# EasyEDA schematic launch-pad_board_schematic_r1.1.json
TITLE: Launch-Pad - Board; REV: 1.1; Date: 2022-09-24; Sheet: 1/1; Company: Lrocket
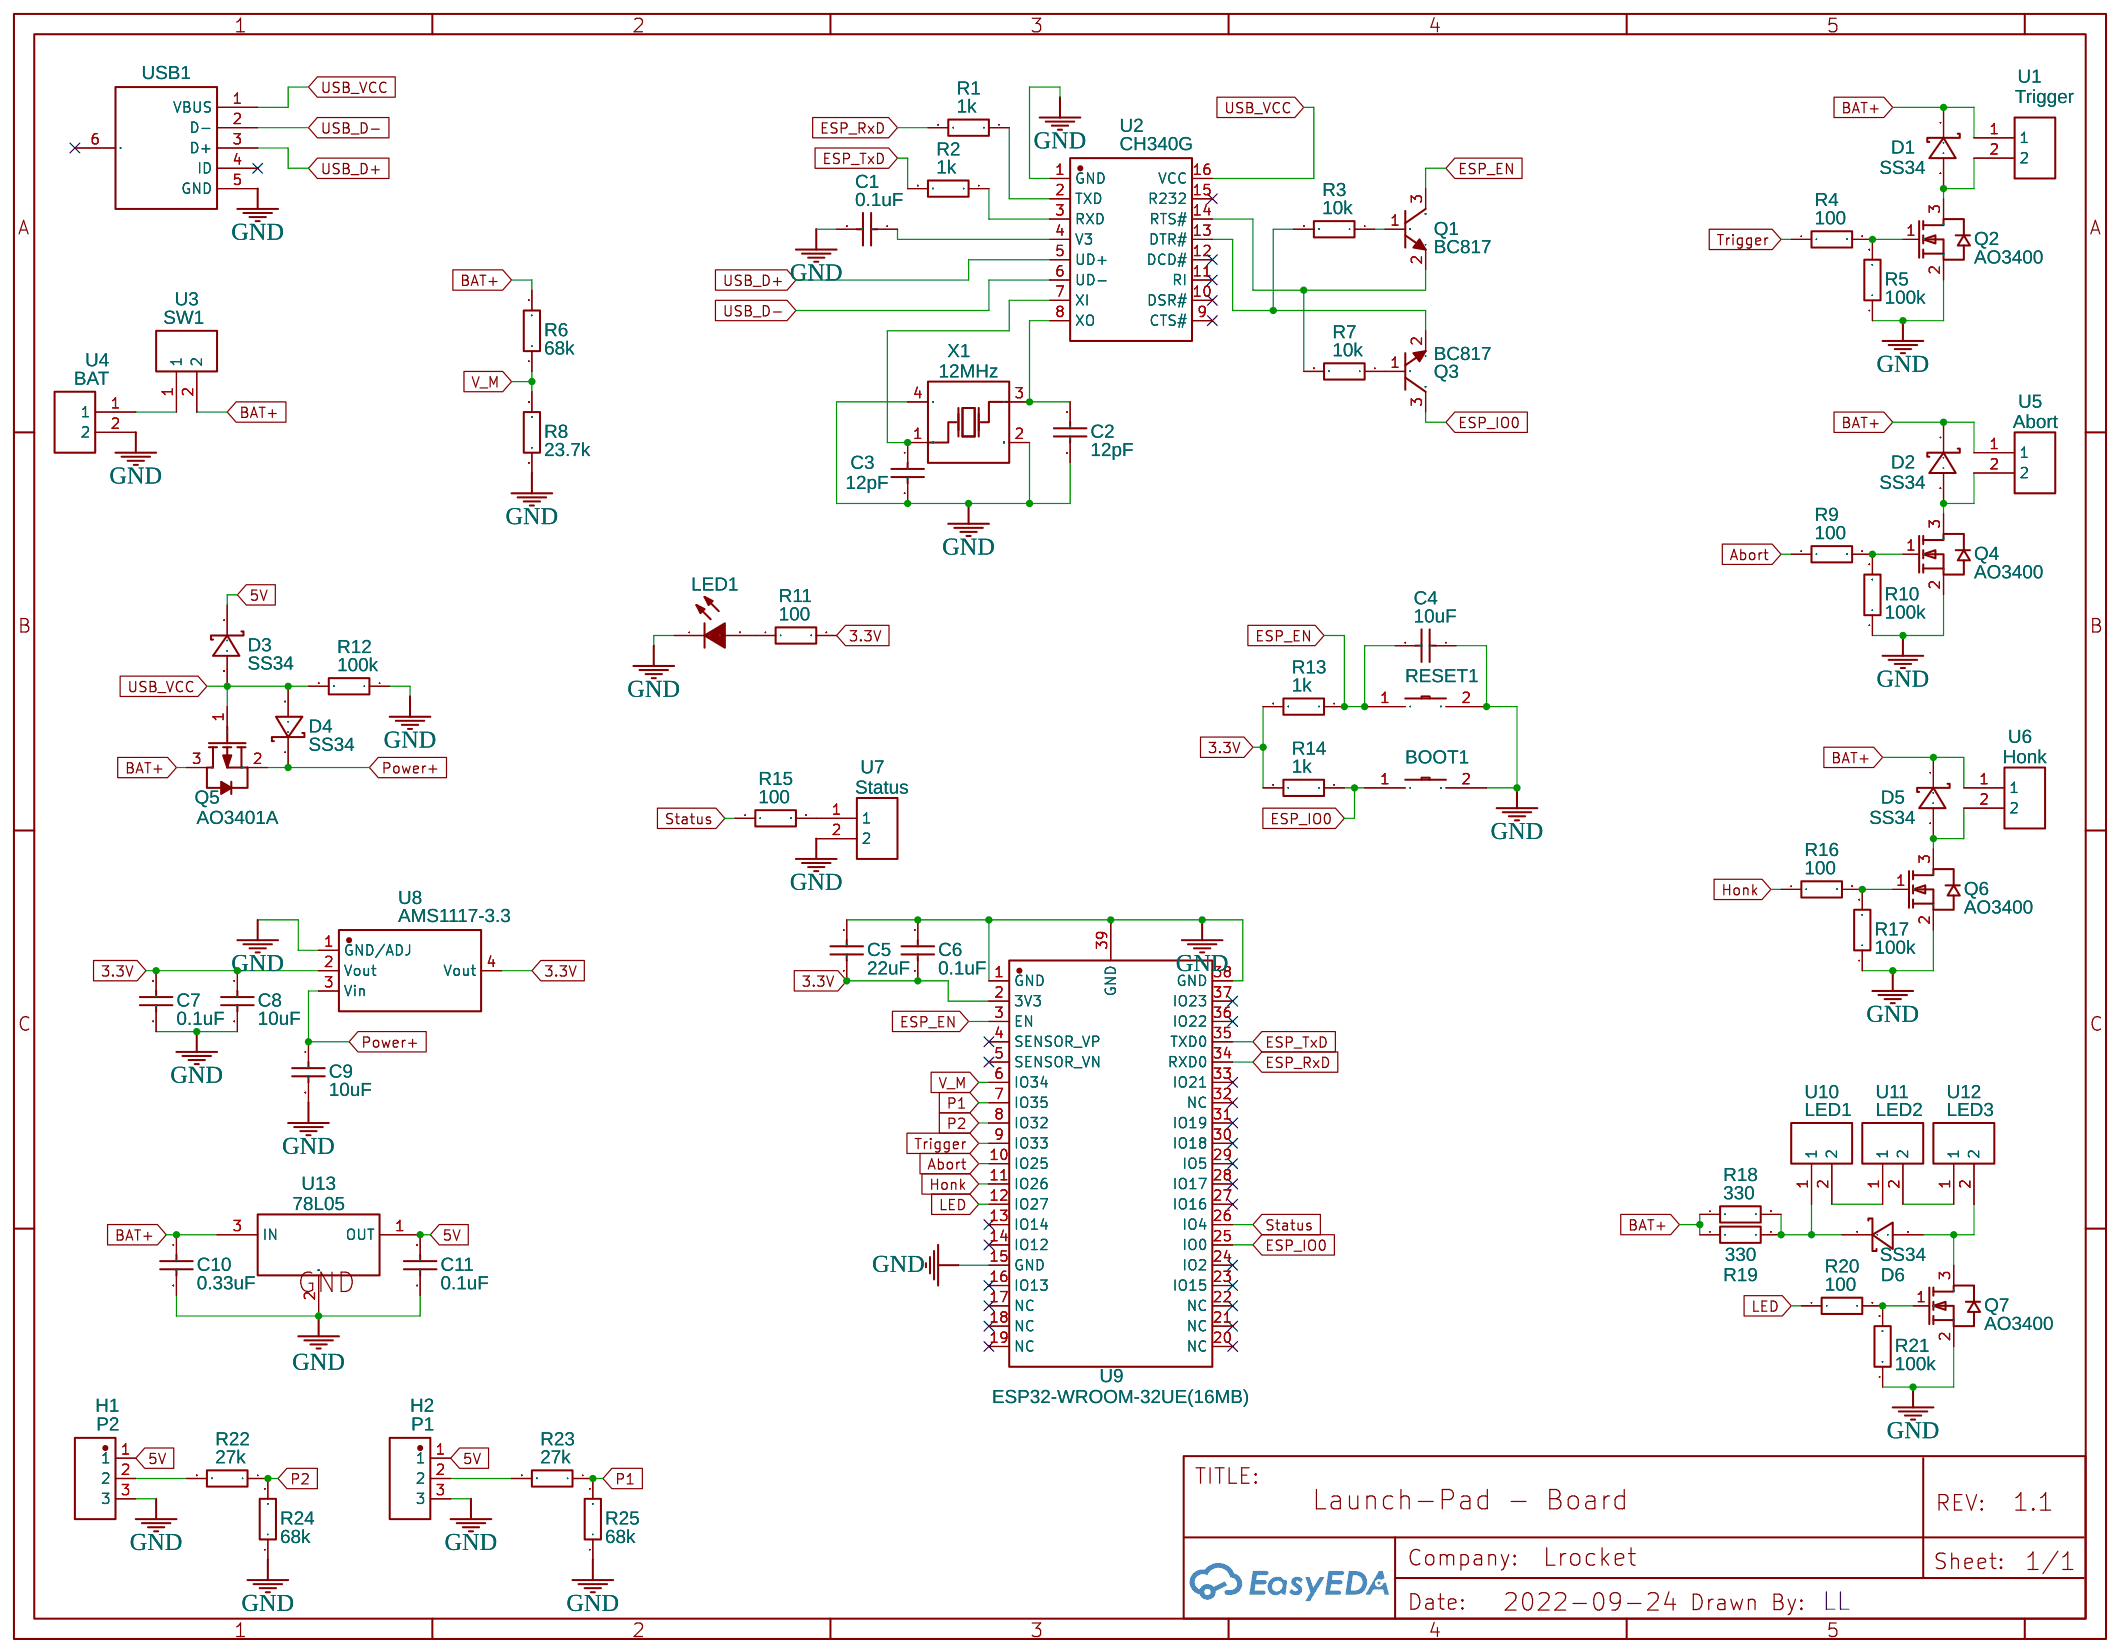
[diagram p0: schematic sheet]

## Parts
BOOT1  TS-1101-C-W  [SW-SMD_L6.0-W3.3-LS8.0]
C1  0.1uF  [C0603]
C2  12pF  [C0603]
C3  12pF  [C0603]
C4  10uF  [C0603]
C5  22uF  [C0603]
C6  0.1uF  [C0603]
C7  0.1uF  [C0603]
C8  10uF  [C0603]
C9  10uF  [C0603]
C10  0.33uF  [C0603]
C11  0.1uF  [C0603]
D1  SS34  [DO-214AC_L4.3-W2.7-LS5.3-RD]
D2  SS34  [DO-214AC_L4.3-W2.7-LS5.3-RD]
D3  SS34  [DO-214AC_L4.3-W2.7-LS5.3-RD]
D4  SS34  [DO-214AC_L4.3-W2.7-LS5.3-RD]
D5  SS34  [DO-214AC_L4.3-W2.7-LS5.3-RD]
D6  SS34  [DO-214AC_L4.3-W2.7-LS5.3-RD]
H1  P2  [SMD-HDR_3P_2.54]
H2  P1  [SMD-HDR_3P_2.54]
LED1  FC-D1608WD-460H5  [LED0603-RD]
Q1  BC817  [SOT-23-3_L2.9-W1.6-P1.90-LS2.8-BR]
Q2  AO3400  [SOT-23-3_L2.9-W1.3-P1.90-LS2.4-BR]
Q3  BC817  [SOT-23-3_L2.9-W1.6-P1.90-LS2.8-BR]
Q4  AO3400  [SOT-23-3_L2.9-W1.3-P1.90-LS2.4-BR]
Q5  AO3401A  [SOT-23_L2.9-W1.3-P1.90-LS2.4-BR]
Q6  AO3400  [SOT-23-3_L2.9-W1.3-P1.90-LS2.4-BR]
Q7  AO3400  [SOT-23-3_L2.9-W1.3-P1.90-LS2.4-BR]
R1  1k  [R0603]
R2  1k  [R0603]
R3  10k  [R0603]
R4  100  [R0603]
R5  100k  [R0603]
R6  68k  [R0603]
R7  10k  [R0603]
R8  23.7k  [R0603]
R9  100  [R0603]
R10  100k  [R0603]
R11  100  [R0603]
R12  100k  [R0603]
R13  1k  [R0603]
R14  1k  [R0603]
R15  100  [R0603]
R16  100  [R0603]
R17  100k  [R0603]
R18  330  [R0603]
R19  330  [R0603]
R20  100  [R0603]
R21  100k  [R0603]
R22  27k  [R0603]
R23  27k  [R0603]
R24  68k  [R0603]
R25  68k  [R0603]
RESET1  TS-1101-C-W  [SW-SMD_L6.0-W3.3-LS8.0]
U1  Trigger  [HEADER_SMD2]
U2  CH340G  [SOIC-16_L9.9-W3.9-P1.27-LS6.0-BL]
U3  SW1  [HEADER_SMD2]
U4  BAT  [HEADER_SMD2]
U5  Abort  [HEADER_SMD2]
U6  Honk  [HEADER_SMD2]
U7  Status  [HEADER_SMD2]
U8  AMS1117-3.3  [SOT-223-3_L6.5-W3.4-P2.30-LS7.0-BR]
U9  ESP32-WROOM-32UE(16MB)  [WIFI-SMD_ESP32-WROOM-32UE]
U10  LED1  [HEADER_SMD2]
U11  LED2  [HEADER_SMD2]
U12  LED3  [HEADER_SMD2]
U13  78L05  [SOT-89-3_L4.5-W2.5-P1.50-LS4.2-BR]
USB1  USB1  [MICRO-USB-SMD_U254-051T-4BH83-S1S]
X1  12MHz  [OSC-SMD_4P-L3.2-W2.5-BL]

## Library data of the parts
BOOT1 RESET1 = TS-1101-C-W: Supplier: LCSC; Supplier Part: C318938; Manufacturer: XKB Connectivity(中国星坤); Contributor: LCSC; JLCPCB Part Class: Extended Part
C1-C11 = CC0603KRX7R9BB103: Supplier: LCSC; Manufacturer: YAGEO; Supplier Part: C100042; JLCPCB Part Class: Extended Part
D1-D6 = SS34_C8678: Supplier: LCSC; Manufacturer: MDD; Supplier Part: C8678; JLCPCB Part Class: Basic Part
H1 H2 = 3P SMD: Contributor: LCSC
LED1 = FC-D1608WD-460H5: Supplier: LCSC; Manufacturer: NATIONSTAR; Supplier Part: C84265; JLCPCB Part Class: Extended Part
Q1 Q3 = BC817-25: Supplier: LCSC; Manufacturer: CJ; Supplier Part: C8588; JLCPCB Part Class: Extended Part
Q2 Q4 Q6 Q7 = AO3400A_C347475: Supplier: LCSC; Supplier Part: C347475; Manufacturer: Youtai Semiconductor Co., Ltd.; Manufacturer Part: AO3400A; Contributor: LCSC; JLCPCB Part Class: Extended Part
Q5 = AO3401A: Supplier: LCSC; Manufacturer: AOS; Supplier Part: C15127; JLCPCB Part Class: Basic Part
R1-R25 = TR0603B10KP05250.1W: Supplier: LCSC; Supplier Part: C188363; Manufacturer: Ever Ohms Tech; Contributor: LCSC
U1 U3-U7 U10-U12 = HEADER_SMD2: Manufacturer Part: WGGM; Contributor: diy instinct
U2 = CH340G: Supplier: LCSC; Manufacturer: WCH; Supplier Part: C14267; JLCPCB Part Class: Extended Part
U8 = AMS1117-3.3: sourceId: dwIGgezVh; Supplier: LCSC; Manufacturer: AMS; Supplier Part: C6186; JLCPCB Part Class: Basic Part
U9 = ESP32-WROOM-32UE(16MB): Supplier: LCSC; Supplier Part: C701346; Manufacturer: Espressif Systems; Contributor: LCSC; JLCPCB Part Class: Extended Part
U13 = UMW78L05: Supplier: LCSC; Supplier Part: C347258; Manufacturer: Youtai Semiconductor Co., Ltd.; Contributor: LCSC; JLCPCB Part Class: Extended Part
USB1 = U254-051T-4BH83-S1S: Supplier: LCSC; Supplier Part: C319160; Manufacturer: XKB Enterprise; Contributor: LCSC; JLCPCB Part Class: Extended Part
X1 = X322512MOB4SI: Supplier: LCSC; Manufacturer: YXC; Supplier Part: C70565; JLCPCB Part Class: Extended Part

## Nets
3.3V: C5.2 C6.2 C7.1 C8.1 R11.2 R13.2 R14.2 U8.2(Vout) U8.4(Vout) U9.2(3V3)
5V: C11.1 D3.1(K) H1.1 H2.1 U13.1(OUT)
GND: BOOT1.2 C1.2 C2.2 C3.2 C4.1 C5.1 C6.1 C7.2 C8.2 C9.2 C10.2 C11.2 H1.3 H2.3 LED1.1(-) Q2.2(S) Q4.2(S) Q6.2(S) Q7.2(S) R5.1 R8.1 R10.1 R12.1 R17.1 R21.1 R24.1 R25.1 RESET1.2 U2.1(GND) U4.2 U7.2 U8.1(GND/ADJ) U9.1(GND) U9.15(GND) U9.38(GND) U9.39(GND) U13.2(GND) USB1.5(GND) X1.2(GND) X1.4(GND)
Abort: R9.1 U9.10(IO25)
BAT+: C10.1 D1.1(K) D2.1(K) D5.1(K) Q5.3(D) R6.2 R18.1 R19.1 U1.1 U3.2 U5.1 U6.1 U13.3(IN)
ESP_EN: C4.2 Q1.3(C) R13.1 RESET1.1 U9.3(EN)
ESP_IO0: BOOT1.1 Q3.3(C) R14.1 U9.25(IO0)
ESP_RxD: R1.2 U9.34(RXD0)
ESP_TxD: R2.2 U9.35(TXD0)
Honk: R16.1 U9.11(IO26)
LED: R20.1 U9.12(IO27)
P1: R23.1 R25.2 U9.7(IO35)
P2: R22.1 R24.2 U9.8(IO32)
Power+: C9.1 D4.1(K) Q5.2(S) U8.3(Vin)
Status: R15.1 U9.26(IO4)
Trigger: R4.1 U9.9(IO33)
USB_D+: U2.5(UD+) USB1.3(D+)
USB_D-: U2.6(UD-) USB1.2(D-)
USB_VCC: D3.2(A) D4.2(A) Q5.1(G) R12.2 U2.16(VCC) USB1.1(VBUS)
V_M: R6.1 R8.2 U9.6(IO34)
Net-(C1-1): C1.1 U2.4(V3)
Net-(C2-1): C2.1 U2.8(XO) X1.3(OSC2)
Net-(C3-1): C3.1 U2.7(XI) X1.1(OSC1)
Net-(D1-2): D1.2(A) Q2.3(D) U1.2
Net-(D2-2): D2.2(A) Q4.3(D) U5.2
Net-(D5-2): D5.2(A) Q6.3(D) U6.2
Net-(D6-1): D6.1(K) R18.2 R19.2 U10.1
Net-(D6-2): D6.2(A) Q7.3(D) U12.2
Net-(H1-2): H1.2 R22.2
Net-(H2-2): H2.2 R23.2
Net-(LED1-2): LED1.2(+) R11.1
Net-(Q1-1): Q1.1(B) R3.1
Net-(Q1-2): Q1.2(E) R7.2 U2.14(RTS#)
Net-(Q2-1): Q2.1(G) R4.2 R5.2
Net-(Q3-1): Q3.1(B) R7.1
Net-(Q3-2): Q3.2(E) R3.2 U2.13(DTR#)
Net-(Q4-1): Q4.1(G) R9.2 R10.2
Net-(Q6-1): Q6.1(G) R16.2 R17.2
Net-(Q7-1): Q7.1(G) R20.2 R21.2
Net-(R1-1): R1.1 U2.2(TXD)
Net-(R2-1): R2.1 U2.3(RXD)
Net-(R15-2): R15.2 U7.1
Net-(U3-1): U3.1 U4.1
Net-(U10-2): U10.2 U11.1
Net-(U11-2): U11.2 U12.1

Not connected (* = marked no-connect by the designer): U2 9(CTS#)* 10(DSR#)* 11(RI)* 12(DCD#)* 15(R232)*; U9 4(SENSOR_VP)* 5(SENSOR_VN)* 13(IO14)* 14(IO12)* 16(IO13)* 17(NC)* 18(NC)* 19(NC)* 20(NC)* 21(NC)* 22(NC)* 23(IO15)* 24(IO2)* 27(IO16)* 28(IO17)* 29(IO5)* 30(IO18)* 31(IO19)* 32(NC)* 33(IO21)* 36(IO22)* 37(IO23)*; USB1 4(ID)* 6(EH)*

## Notes on the sheet
- LL
